# EAGLE design FWR (EAGLE 9.6.2)
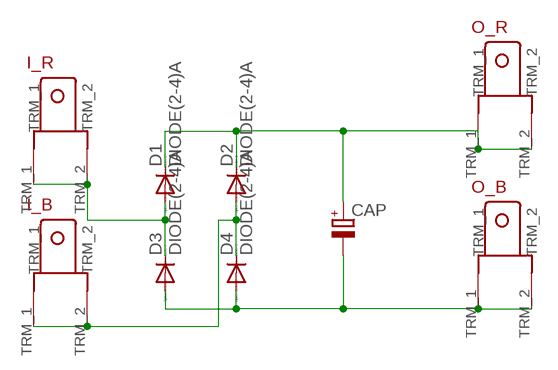
[diagram p0: schematic, sheet 1]

## Parts
CAP  CAP_POL  [E3,5-8]
D1  DIODE(2-4)A  [DO35-10]
D2  DIODE(2-4)A  [DO35-10]
D3  DIODE(2-4)A  [DO35-10]
D4  DIODE(2-4)A  [DO35-10]
I_B  TERMINAL_EDITED  [TERMINAL_EDITED]
I_R  TERMINAL_EDITED  [TERMINAL_EDITED]
O_B  TERMINAL_EDITED  [TERMINAL_EDITED]
O_R  TERMINAL_EDITED  [TERMINAL_EDITED]

## Nets
D1: CAP.+ D1.C D2.C O_R.TRM_1 O_R.TRM_2
N$6: D2.A D4.C I_B.TRM_1 I_B.TRM_2
N$7: D1.A D3.C I_R.TRM_1 I_R.TRM_2
N$9: CAP.- D3.A D4.A O_B.TRM_1 O_B.TRM_2

## Library data of the parts
CAP = MIA_LIBRARY-2-2-2:CAP_POL
D1-D4 = MIA_LIBRARY-2-2-2:DIODE(2-4)A: DIODE high speed (Philips)
I_B I_R O_B O_R = MIA_LIBRARY-2-2-2:TERMINAL_EDITED

## Board
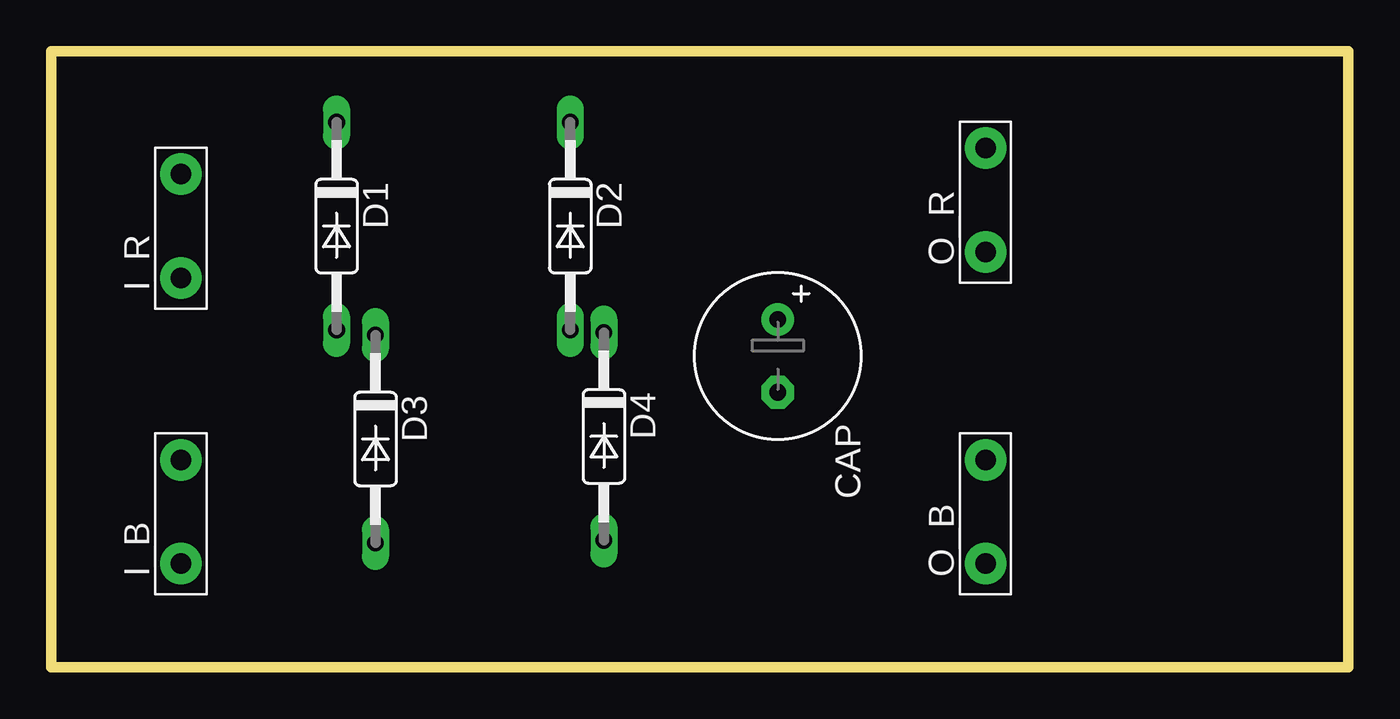
[diagram p1: board, top side]
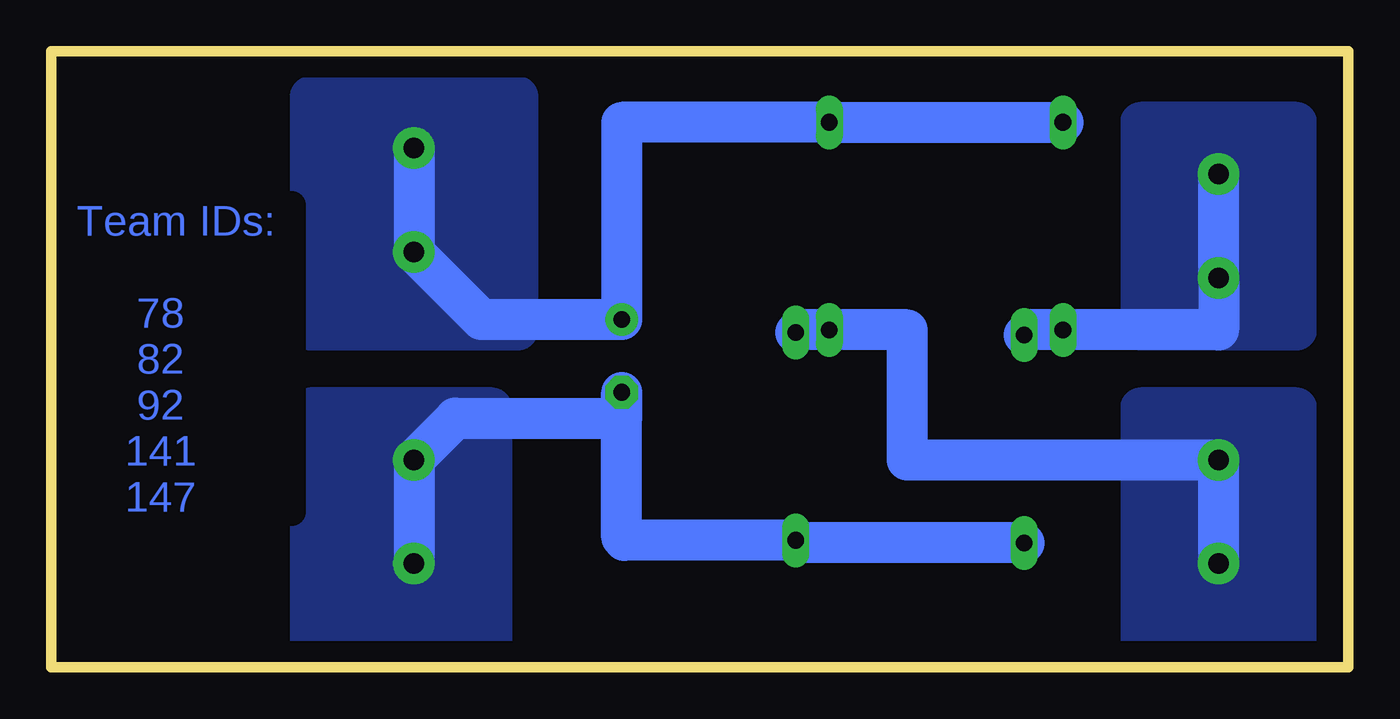
[diagram p2: board, bottom side, seen from below]

Size 63.48 x 30.15 mm. Coordinates in mm from the lower left corner, seen from the top.
Outline: 0,0 63.48,0 63.48,30.15 0,30.15 0,0
Copper layers (1*16): Top 0.035mm / dielectric 1.5mm / Bottom 0.035mm
Design rules "default *": minimum track width 1mm, minimum drill 0.35mm, track to track 0.7mm, track to pad 0.7mm, pad to pad 6mil, via to via 6mil, smd to smd 6mil, copper to edge 40mil, drill to drill 6mil, minimum pad ring 10mil, minimum via ring 8mil, stop-mask expansion 4mil, vias tented up to drill 0mil, thermal gap 10mil

### Footprints (pad centres in the part's own frame; a part is rotated, then mirrored left to right if it is on the bottom)
E3,5-8 = drill 0.813 pad 1.6: + -1.778,0 | drill 0.813 pad 1.6 octagon: - 1.778,0
DO35-10 = drill 0.813 long: A 5.08,0; C -5.08,0
TERMINAL_EDITED = drill 1 pad 2.032: TRM_1 -2.54,0; TRM_2 2.54,0

### Placement (x,y rotation side)
CAP  35.56,15.24 270 top
D1  13.97,21.59 270 top
D2  25.4,21.59 270 top
D3  15.88,11.18 270 top
D4  27.05,11.3 270 top
I_B  6.35,7.62 90 top
I_R  6.35,21.59 90 top
O_B  45.72,7.62 90 top
O_R  45.72,22.86 90 top

### Tracks (layer width: path | path; a pad name or v marks a point on that pad's centre or on a via)
D1
  Bottom 2: D1.C D2.C 35.56,26.67 CAP.+ 42.42,17.02 O_R.TRM_1 O_R.TRM_2
  pour Bottom: 40.64,27.94 50.8,27.94 50.8,16.51 40.64,16.51
N$6
  Bottom 2: I_B.TRM_1 I_B.TRM_2 21.59,10.16 21.59,16.51 D2.A 26.92,16.51 D4.C
  pour Bottom: 2.54,12.7 10.16,12.7 10.16,1.27 2.54,1.27
N$7
  Bottom 2: I_R.TRM_2 I_R.TRM_1 6.35,16.51 D1.A 15.62,16.51 D3.C
  pour Bottom: 2.54,26.67 10.16,26.67 10.16,16.51 2.54,16.51
N$9
  Bottom 2: O_B.TRM_1 O_B.TRM_2 43.69,12.19 35.56,12.19 CAP.- 35.56,6.35 35.43,6.22 D4.A 26.92,6.1 D3.A
  pour Bottom: 41.91,12.7 50.8,12.7 50.8,1.27 41.91,1.27

### Text on the board
Bottom: Team IDs: / / 78 / 82 / 92 / 141 / 147